# Altium schematic sheet igrid_sensor.SchDoc
size A3
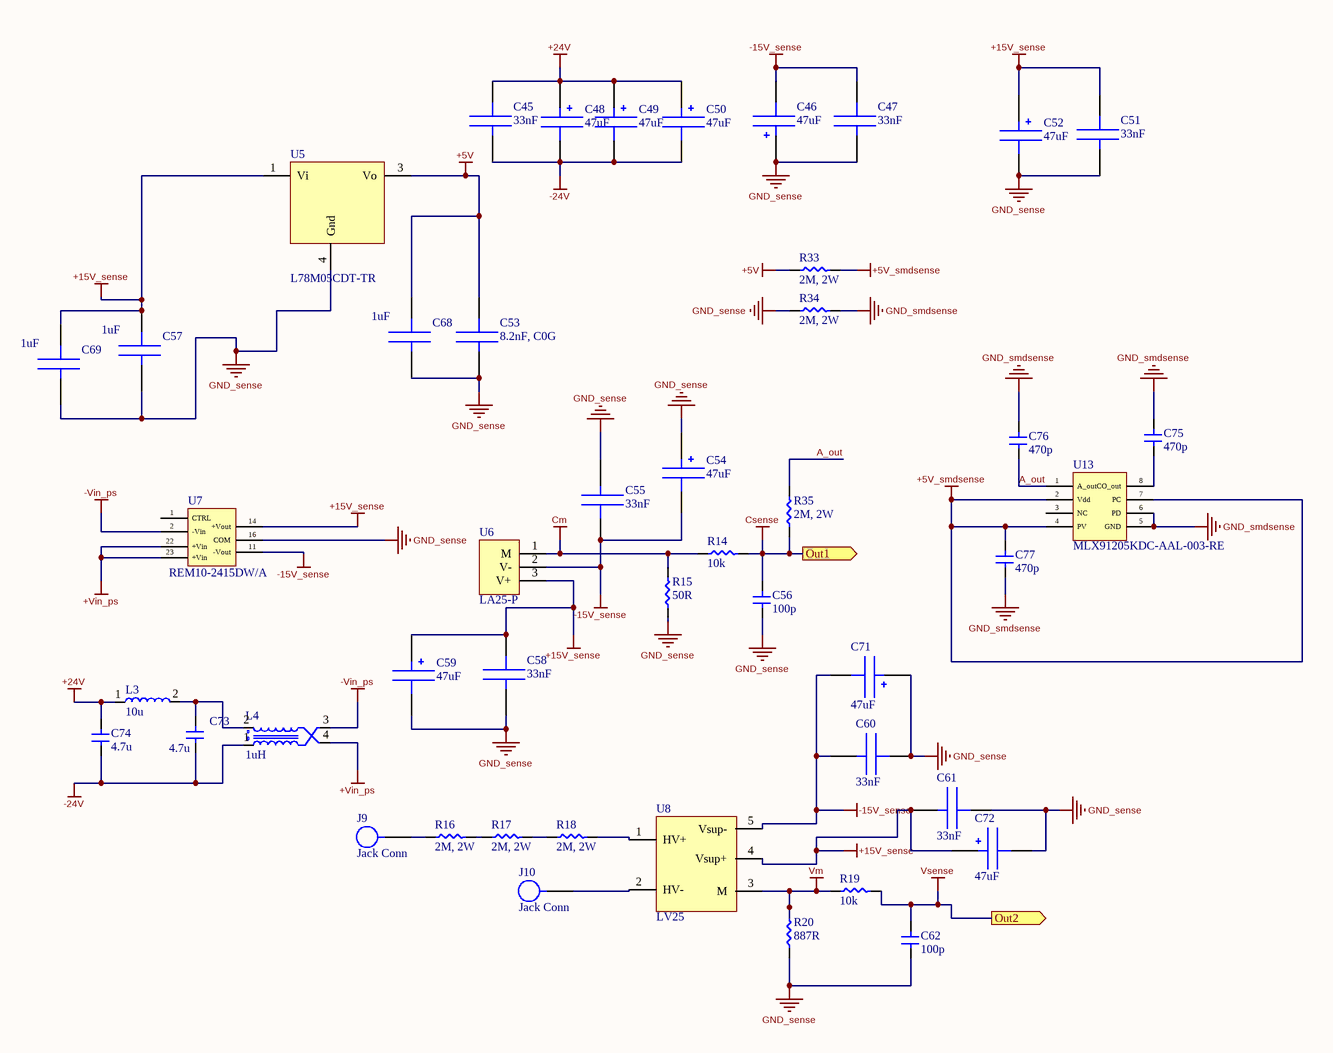
[diagram p0: igrid_sensor.SchDoc]

## Parts
C45  33nF  [C1206]
C46  47uF  [CAPAE7266X82N]
C47  33nF  [C1206]
C48  47uF  [CAPAE7266X82N]
C49  47uF  [CAPAE7266X82N]
C50  47uF  [CAPAE7266X82N]
C51  33nF  [C1206]
C52  47uF  [CAPAE7266X82N]
C53  8.2nF, C0G  [C1206]
C54  47uF  [CAPAE7266X82N]
C55  33nF  [C1206]
C56  100p  [C0603]
C57  1uF  [C1206]
C58  33nF  [C1206]
C59  47uF  [CAPAE7266X82N]
C60  33nF  [C1206]
C61  33nF  [C1206]
C62  100p  [C0603]
C68  1uF  [C1206]
C69  1uF  [C1206]
C71  47uF  [CAPAE7266X82N]
C72  47uF  [CAPAE7266X82N]
C73  4.7u  [C0805]
C74  4.7u  [C0805]
C75  470p  [C0603]
C76  470p  [C0603]
C77  470p  [C0603]
J9  Jack Conn  [575-4]
J10  Jack Conn  [575-4]
L3  10u  [SRP4020TA-100M]
L4  1uH  [744282010]
R14  10k  [R0603]
R15  50R  [R0603]
R16  2M, 2W  [R2010]
R17  2M, 2W  [R2010]
R18  2M, 2W  [R2010]
R19  10k  [R0603]
R20  887R  [R0603]
R33  2M, 2W  [R2010]
R34  2M, 2W  [R2010]
R35  2M, 2W  [R2010]
U5  L78M05CDT-TR  [DPAK_LM7805]
U6  LA25-P  [LA 25-P]
U7  REM10-2415DW/A  [REM10-2415DW/A]
U8  LV25  [LV25-P]
U13  MLX91205KDC-AAL-003-RE  [SOIC-8]

## Ports
Out1 (out), Out2 (out)

## Nets
+5V: C53.2 C68.2 R33.1 U5.3(Vo)
+5V_smdsense: C77.2 R33.2 U13.2(Vdd) U13.4(PV) U13.7(PC)
+15V_sense: C51.2 C52.1 C57.2 C58.2 C59.1 C61.1 C69.2 C72.1 U5.1(Vi) U6.3(V+) U7.14(+Vout) U8.4(Vsup+)
+24V: C45.2 C48.1 C49.1 C50.1 C74.2 L3.1
+Vin_ps: L4.4 U7.22(+Vin) U7.23(+Vin)
-15V_sense: C46.2 C47.2 C54.2 C55.2 C60.1 C71.2 U6.2(V-) U7.11(-Vout) U8.5(Vsup-)
-24V: C45.1 C48.2 C49.2 C50.2 C73.1 C74.1 L4.1
-Vin_ps: L4.3 U7.2(-Vin)
Cm: R14.1 R15.2 U6.1(M)
Csense: C56.2 R14.2 R35.1 ; port Out1
GND_sense: C46.1 C47.1 C51.1 C52.2 C53.1 C54.1 C55.1 C56.1 C57.1 C58.1 C59.2 C60.2 C61.2 C62.1 C68.1 C69.1 C71.1 C72.2 R15.1 R20.1 R34.1 U5.4(Gnd) U7.16(COM)
GND_smdsense: C75.2 C76.2 C77.1 R34.2 U13.5(GND) U13.6(PD)
Vm: R19.1 R20.2 U8.3(M)
Vsense: C62.2 R19.2 ; port Out2
A_out: C76.1 R35.2 U13.1(A_out)
NetC73_2: C73.2 L3.2 L4.2
NetC75_1: C75.1 U13.8(CO_out)
NetJ9_1: J9.1 R16.1
NetJ10_1: J10.1 U8.2(HV-)
NetR16_2: R16.2 R17.1
NetR17_2: R17.2 R18.1
NetR18_2: R18.2 U8.1(HV+)

Not connected (* = marked no-connect by the designer): U7 1(CTRL); U13 3(NC)

## Library data of the parts
C45 C47 C51 C55 C58 C60 C61 = CL31B333JBCNNNC: Cap Ceramic 0.033uF 50V X7R 5% SMD 1206 125C Paper T/R; Manufacturer: Samsung; Supplier 1: Digi-Key; Manufacturer Part Number: CL31B333JBCNNNC; Stock 1: 21; Pricing 1: 1=0.18, 10=0.131, 100=0.0614, 500=0.04308, 1000=0.03567 (USD); Mount: Surface Mount; Case/Package: 1206; Case Code (Metric): 3216; Case Code (Imperial): 1206; Min Operating Temperature: -55°C; Max Operating Temperature: 125°C; Tolerance: 5%; Packaging: Tape and Reel; Capacitance: 33nF; Voltage Rating: 50V; Package Quantity: 1; Dielectric: X7R; Voltage: 50V; Voltage Rating (DC): 50V; Length: 3.2mm; Height: 0.85mm; Width: 0.063inch; Thickness: 0.039inch; Depth: 1.6mm; Radiation Hardening: No; Lead Free: Lead Free; Supplier Part Number 1: 1276-1774-6-ND
C46 C48-C50 C52 C54 C59 C71 C72 = UCD1H470MCL1GS: Aluminum Electrolytic Capacitors - SMD 47uF 50V 105c; Manufacturer: Nichicon; Tolerance: 20%; Impedance: 630mR; Life (Hours): 2000Hour; Ripple Current: 195mA; Leakage Current: 493.5uA; Dissipation Factor: 0.1%; Supplier 1: Digi-Key; Manufacturer Part Number: UCD1H470MCL1GS; Stock 1: 232; Pricing 1: 1=0.55, 10=0.39, 100=0.2566 (USD); Mount: Surface Mount; Case/Package: Radial; Min Operating Temperature: -55°C; Max Operating Temperature: 105°C; Capacitance: 47uF; Voltage Rating: 50V; Packaging: Tape and Reel; Package Quantity: 1; Voltage Rating (DC): 50V; Termination: SMD/SMT; Voltage: 50V; Diameter: 6.3mm; Length: 7.7mm; Height: 7.7mm; Height - Seated (Max): 0.315inch; Radiation Hardening: No; Lead Free: Lead Free; ComponentLink1URL: http://www.nichicon.co.jp/english/products/pdfs/e-cd.pdf; ComponentLink1Description: http://www.nichicon.co.jp/english/products/pdfs/e-cd.pdf; ComponentLink2URL: http://nichicon-us.com/english/products/pdfs/e-ucd.pdf; ComponentLink2Description: http://nichicon-us.com/english/products/pdfs/e-ucd.pdf; ComponentLink3URL: http://uk.rs-online.com/webdocs/0ebd/0900766b80ebdadd.pdf; ComponentLink3Description: http://uk.rs-online.com/webdocs/0ebd/0900766b80ebdadd.pdf; ComponentLink4URL: http://products.nichicon.co.jp/en/pdf/XJA043/e-cd.pdf; ComponentLink4Description: http://products.nichicon.co.jp/en/pdf/XJA043/e-cd.pdf; Supplier Part Number 1: 493-6183-6-ND
C53 = C1206C822JAGACAUTO: Multilayer Ceramic Capacitors MLCC - SMD/SMT 250volts 8200pF 5% C0G AUTO; Manufacturer: KEMET; Voltage Rating: 250V; Supplier 1: Digi-Key; Manufacturer Part Number: C1206C822JAGACAUTO; Stock 1: 3011; Pricing 1: 1=0.69, 10=0.489, 100=0.3223, 500=0.23872, 1000=0.20292 (USD); Mount: Surface Mount; Case/Package: 1206; Weight: 0.000353oz; Case Code (Metric): 3216; Case Code (Imperial): 1206; Dielectric Material: Ceramic; Min Operating Temperature: -55°C; Max Operating Temperature: 125°C; Capacitance: 8.2nF; Packaging: Tape and Reel; Tolerance: 5%; Dielectric: C0G; Termination: SMD/SMT; Voltage Rating (DC): 250V; Package Quantity: 4000; Length: 0.126inch; Width: 1.6mm; Thickness: 0.039inch; Ratings: AEC-Q200; Lead Free: Lead Free; Supplier Part Number 1: 399-11910-6-ND
C56 C62 = 06035C101KAT2A: Cap Ceramic 100pF 50V X7R 10% SMD 0603 125C T/R; Manufacturer: Kyocera AVX; Dissipation Factor: 2.5%; Temperature Coefficient: 0ppm/°C; Supplier 1: Mouser; Manufacturer Part Number: 06035C101KAT2A; Stock 1: 28330; Pricing 1: 1=0.27, 10=0.181, 50=0.181, 100=0.091, 1000=0.055, 10000=0.038 (USD); Mount: Surface Mount; Case/Package: 0603; Number of Pins: 2; Case Code (Metric): 1608; Case Code (Imperial): 0603; Contact Plating: Tin,Matte; Dielectric Material: Ceramic; Min Operating Temperature: -55°C; Max Operating Temperature: 125°C; Package Quantity: 1; Capacitance: 100pF; Tolerance: 10%; Packaging: Tape and Reel; Voltage Rating: 50V; Voltage Rating (DC): 50V; Dielectric: X7R; Termination: SMD/SMT; Length: 1.6mm; Width: 0.032inch; Thickness: 0.035inch; Depth: 0.81mm; Radiation Hardening: No; REACH SVHC: No SVHC; Lead Free: Lead Free; ComponentLink1URL: http://www.mouser.com/ds/2/40/X7RDielectric-777024.pdf?src-supplier=Mouser; ComponentLink1Description: http://www.mouser.com/ds/2/40/X7RDielectric-777024.pdf?src-supplier=Mouser; ComponentLink2URL: http://www.farnell.com/datasheets/1679506.pdf?src-supplier=Element14; ComponentLink2Description: http://www.farnell.com/datasheets/1679506.pdf?src-supplier=Element14; ComponentLink3URL: http://www.jameco.com/Jameco/Products/ProdDS/2012486.pdf?src-supplier=Jameco; ComponentLink3Description: http://www.jameco.com/Jameco/Products/ProdDS/2012486.pdf?src-supplier=Jameco; ComponentLink4URL: http://www.avx.com/docs/Catalogs/cx7r.pdf?src-supplier=Future+Electronics; ComponentLink4Description: http://www.avx.com/docs/Catalogs/cx7r.pdf?src-supplier=Future+Electronics; ComponentLink5URL: http://catalogs.avx.com/SurfaceMount.pdf?src-supplier=Digi-Key; ComponentLink5Description: http://catalogs.avx.com/SurfaceMount.pdf?src-supplier=Digi-Key; Supplier Part Number 1: 581-06035C101K
C57 C68 C69 = C1206C822JAGACAUTO: Multilayer Ceramic Capacitors MLCC - SMD/SMT 250volts 8200pF 5% C0G AUTO; Manufacturer: KEMET; Capacitance: 8.2nF; Voltage Rating: 250V; Supplier 1: Digi-Key; Manufacturer Part Number: C1206C822JAGACAUTO; Stock 1: 3011; Pricing 1: 1=0.69, 10=0.489, 100=0.3223, 500=0.23872, 1000=0.20292 (USD); Mount: Surface Mount; Case/Package: 1206; Weight: 0.000353oz; Case Code (Metric): 3216; Case Code (Imperial): 1206; Dielectric Material: Ceramic; Min Operating Temperature: -55°C; Max Operating Temperature: 125°C; Packaging: Tape and Reel; Tolerance: 5%; Dielectric: C0G; Termination: SMD/SMT; Voltage Rating (DC): 250V; Package Quantity: 4000; Length: 0.126inch; Width: 1.6mm; Thickness: 0.039inch; Ratings: AEC-Q200; Lead Free: Lead Free; Supplier Part Number 1: 399-11910-6-ND
C73 C74 = CGA4C2C0G1H103J060AA: CAP CER 10000PF 50V C0G 0805; Manufacturer: TDK; Tolerance: 5%; Capacitance: 10nF; Supplier 1: Digi-Key; Manufacturer Part Number: CGA4C2C0G1H103J060AA; Stock 1: 310; Pricing 1: 1=0.4, 10=0.273, 100=0.1548, 500=0.1093, 1000=0.09563 (USD); Mount: Surface Mount; Case/Package: 0805; Weight: 0.000194oz; Case Code (Metric): 2012; Case Code (Imperial): 0805; Min Operating Temperature: -55°C; Max Operating Temperature: 125°C; Packaging: Tape and Reel; Package Quantity: 1; Voltage Rating: 50V; Voltage Rating (DC): 50V; Dielectric: C0G; Termination: SMD/SMT; Composition: Ceramic; Length: 2mm; Height: 0.6mm; Width: 0.049inch; Thickness: 0.028inch; Depth: 1.25mm; Ratings: AEC-Q200; Radiation Hardening: No; REACH SVHC: No SVHC; Lead Free: Lead Free; ComponentLink1URL: https://www.verical.com/server-webapp/html/getDatasheet?partID=712412; ComponentLink1Description: https://www.verical.com/server-webapp/html/getDatasheet?partID=712412; ComponentLink2URL: http://www.mouser.com/ds/2/400/lcc_automotive_general_en-843974.pdf; ComponentLink2Description: http://www.mouser.com/ds/2/400/lcc_automotive_general_en-843974.pdf; Supplier Part Number 1: 445-6947-6-ND
C75-C77 = CC0603KRX7R9BB471: Manufacturer: Yageo; Dielectric Material: Ceramic; Capacitance: 470pF; Tolerance: 10%; Voltage Rating: 50V; Dielectric: X7R; Insulation Resistance: 10GR; Dissipation Factor: 2.5%; Supplier 1: Mouser; Manufacturer Part Number: CC0603KRX7R9BB471; Stock 1: 58906; Pricing 1: 1=0.1, 10=0.039, 50=0.039, 100=0.018, 1000=0.014, 10000=0.01 (USD); Mount: Surface Mount; Case/Package: 0603; Number of Pins: 2; Case Code (Imperial): 0603; Case Code (Metric): 1608; Min Operating Temperature: -55°C; Max Operating Temperature: 125°C; Voltage Rating (DC): 50V; Packaging: Tape and Reel; Package Quantity: 1; Termination: SMD/SMT; Composition: Ceramic; Length: 1.6mm; Height: 0.8mm; Width: 0.8mm; Thickness: 0.035inch; Depth: 0.8mm; Radiation Hardening: No; REACH SVHC: No SVHC; Lead Free: Lead Free; Halogen Free: Halogen Free; ComponentLink1URL: http://www.mouser.com/ds/2/447/Yageo_UPY-GP_NP0_16V-to-50V_9-358835.pdf?src-supplier=Mouser; ComponentLink1Description: http://www.mouser.com/ds/2/447/Yageo_UPY-GP_NP0_16V-to-50V_9-358835.pdf?src-supplier=Mouser; ComponentLink2URL: http://www.yageo.com/documents/recent/UPY-GPHC_X7R_6.3V-to-50V_18.pdf?src-supplier=Digi-Key; ComponentLink2Description: http://www.yageo.com/documents/recent/UPY-GPHC_X7R_6.3V-to-50V_18.pdf?src-supplier=Digi-Key; ComponentLink3URL: http://www.yageo.com/documents/recent/UPY-GPHC_X7R_6.3V-to-50V_8.pdf?src-supplier=Avnet; ComponentLink3Description: http://www.yageo.com/documents/recent/UPY-GPHC_X7R_6.3V-to-50V_8.pdf?src-supplier=Avnet; ComponentLink4URL: http://www.yageo.com/documents/recent/UPY-GPHC_X7R_6.3V-to-50V_8.pdf?src-supplier=Avnet+Europe; ComponentLink4Description: http://www.yageo.com/documents/recent/UPY-GPHC_X7R_6.3V-to-50V_8.pdf?src-supplier=Avnet+Europe; ComponentLink5URL: http://www.farnell.com/datasheets/1489800.pdf?src-supplier=Element14; ComponentLink5Description: http://www.farnell.com/datasheets/1489800.pdf?src-supplier=Element14; ComponentLink6URL: https://www.verical.com/server-webapp/html/getDatasheet?partID=251791&src-supplier=Verical; ComponentLink6Description: https://www.verical.com/server-webapp/html/getDatasheet?partID=251791&src-supplier=Verical; ComponentLink7URL: http://www.farnell.com/datasheets/70765.pdf?src-supplier=Element14; ComponentLink7Description: http://www.farnell.com/datasheets/70765.pdf?src-supplier=Element14; Supplier Part Number 1: 603-CC603KRX7R9BB471
J9 J10 = 575-4: JACK NON-INSULATED .218"; Manufacturer: Keystone Electronics; Gender: Female; Number of Positions: 1; Supplier 1: Digi-Key; Manufacturer Part Number: 575-4; Stock 1: 21251; Pricing 1: 1=0.84, 10=0.692, 50=0.6244, 250=0.543, 1000=0.4558, 2500=0.4073, 5000=0.3801 (USD); Mount: Panel,Through Hole; Number of Pins: 1; Contact Plating: Nickel; Color: White; Contact Material: Brass; Material: Brass,Tin; Packaging: Bulk; Package Quantity: 100; Termination: Solder; Insulation: Non-Insulated; Lead Free: Lead Free; ComponentLink1URL: http://www.mouser.com/ds/2/215/75-4_575-8-743912.pdf?src-supplier=Mouser; ComponentLink1Description: http://www.mouser.com/ds/2/215/75-4_575-8-743912.pdf?src-supplier=Mouser; ComponentLink2URL: http://www.keyelco.com/pdfs/M60/M60p107.pdf?src-supplier=Digi-Key; ComponentLink2Description: http://www.keyelco.com/pdfs/M60/M60p107.pdf?src-supplier=Digi-Key; Supplier Part Number 1: 36-575-4-ND
L3 = SRP4020TA-100M: Ind Power Shielded Wirewound 10uH 20% 100KHz Carbonyl Powder 1.8A T/R; Manufacturer: Bourns; Saturation Current: 2.3A; DC Resistance (DCR): 243mR; Self Resonant Frequency: 19MHz; Supplier 1: Digi-Key; Manufacturer Part Number: SRP4020TA-100M; Stock 1: 12652; Pricing 1: 1=1.49, 10=1.383, 100=0.9999, 500=0.7659, 1000=0.6808 (USD); Mount: Surface Mount; Case/Package: SMD/SMT; Number of Pins: 2; Core Material: Carbonyl Powder; Min Operating Temperature: -40°C; Max Operating Temperature: 150°C; Tolerance: 20%; Packaging: Cut Tape; Composition: Wirewound; Inductance: 10uH; Current Rating: 1.8A; Shielding: Shielded; Test Frequency: 100kHz; Max DC Current: 1.8A; Termination: SMD/SMT; RMS Current (Irms): 1.8A; Inductance Tolerance: 20%; Length: 0.175inch; Height: 1.8mm; Width: 0.16inch; Height - Seated (Max): 0.079inch; Depth: 4.06mm; Ratings: AEC-Q200; REACH SVHC: No SVHC; ComponentLink1URL: http://www.bourns.com/docs/Product-Datasheets/SRP4020TA.pdf?src-supplier=Digi-Key; ComponentLink1Description: http://www.bourns.com/docs/Product-Datasheets/SRP4020TA.pdf?src-supplier=Digi-Key; ComponentLink2URL: http://www.bourns.com/data/global/pdfs/SRP4020TA.pdf?src-supplier=Avnet; ComponentLink2Description: http://www.bourns.com/data/global/pdfs/SRP4020TA.pdf?src-supplier=Avnet; ComponentLink3URL: https://media.digikey.com/pdf/Data%20Sheets/Bourns%20PDFs/SRP4012TA_SRP4020TA_Series_Bltn.pdf?src-supplier=Digi-Key; ComponentLink3Description: https://media.digikey.com/pdf/Data%20Sheets/Bourns%20PDFs/SRP4012TA_SRP4020TA_Series_Bltn.pdf?src-supplier=Digi-Key; ComponentLink4URL: http://www.farnell.com/datasheets/2059708.pdf?src-supplier=Newark; ComponentLink4Description: http://www.farnell.com/datasheets/2059708.pdf?src-supplier=Newark; ComponentLink5URL: http://www.alliedelec.com/images/products/datasheets/bm/BOURNS/70418822.pdf?src-supplier=Allied+Electronics; ComponentLink5Description: http://www.alliedelec.com/images/products/datasheets/bm/BOURNS/70418822.pdf?src-supplier=Allied+Electronics; ComponentLink6URL: http://www.farnell.com/datasheets/2059708.pdf?src-supplier=Farnell; ComponentLink6Description: http://www.farnell.com/datasheets/2059708.pdf?src-supplier=Farnell; ComponentLink7URL: http://www.farnell.com/datasheets/2059708.pdf?src-supplier=Element14; ComponentLink7Description: http://www.farnell.com/datasheets/2059708.pdf?src-supplier=Element14; Supplier Part Number 1: SRP4020TA-100MDKR-ND
L4 = 744282010: CHOKE COM MODE 2 X 1.0UH 4.75A; Manufacturer: Wurth Electronics; Core Material: Ferrite; Impedance: 1.6kR; Number of Lines: 2; Tolerance: 20%; Resistance: 12mR; DC Resistance (DCR): 10mR; Test Frequency: 100kHz; Voltage Rating (DC): 80V; Supplier 1: Digi-Key; Manufacturer Part Number: 744282010; Stock 1: 804; Pricing 1: 1=3.1, 10=3.055, 50=2.76, 100=2.661, 250=2.464 (USD); Mount: Surface Mount; Case/Package: 1260; Min Operating Temperature: -40°C; Max Operating Temperature: 125°C; Package Quantity: 500; Packaging: Tape and Reel; Inductance: 1uH; Current Rating: 4.75A; Current: 4.75A; Max DC Current: 4.75A; Termination: SMD/SMT; Length: 12.5mm; Height: 6.5mm; Width: 12.5mm; Depth: 12.5mm; REACH SVHC: No SVHC; ComponentLink1URL: http://www.farnell.com/datasheets/1735690.pdf?src-supplier=Element14; ComponentLink1Description: http://www.farnell.com/datasheets/1735690.pdf?src-supplier=Element14; ComponentLink2URL: http://katalog.we-online.de/pbs/datasheet/744282010.pdf?src-supplier=Digi-Key; ComponentLink2Description: http://katalog.we-online.de/pbs/datasheet/744282010.pdf?src-supplier=Digi-Key; ComponentLink3URL: https://katalog.we-online.de/pbs/datasheet/744282010.pdf?src-supplier=Digi-Key; ComponentLink3Description: https://katalog.we-online.de/pbs/datasheet/744282010.pdf?src-supplier=Digi-Key; ComponentLink4URL: http://documents.rs-components.com/techlib://itc_doclist_GB.htm?stockno=7445283&src-supplier=RSComponents; ComponentLink4Description: http://documents.rs-components.com/techlib://itc_doclist_GB.htm?stockno=7445283&src-supplier=RSComponents; ComponentLink5URL: http://www.mouser.com/ds/2/445/744282010-244044.pdf?src-supplier=Mouser; ComponentLink5Description: http://www.mouser.com/ds/2/445/744282010-244044.pdf?src-supplier=Mouser; Supplier Part Number 1: 732-2965-6-ND
R14 R19 = RNCP0603FTD10K0: RES 10K OHM 1% 1/8W 0603; Manufacturer: Stackpole Electronics; Resistance: 10kR; Max Power Dissipation: 125mW; Temperature Coefficient: 100ppm/°C; Supplier 1: Digi-Key; Manufacturer Part Number: RNCP0603FTD10K0; Stock 1: 166858; Pricing 1: 1=0.1, 10=0.067, 100=0.0273, 1000=0.01224, 2500=0.01063 (USD); Mount: Surface Mount; Case/Package: 0603; Case Code (Metric): 1608; Case Code (Imperial): 0603; Contact Plating: Tin,Matte; Min Operating Temperature: -55°C; Max Operating Temperature: 155°C; Packaging: Tape and Reel; Tolerance: 1%; Composition: Thin Film; Number of Terminations: 2; Features: Moisture Resistant,Anti-Sulfur; Length: 0.059inch; Height: 0.02inch; Width: 0.031inch; Radiation Hardening: No; Lead Free: Lead Free; Supplier Part Number 1: RNCP0603FTD10K0CT-ND
R15 = ERA3AEB7320V: PANASONIC ELECTRONIC COMPONENTS   ERA3AEB7320V   Surface Mount Chip Resistor, Thin Film, AEC-Q200 ERA Series, 732 ohm, 100 mW,  0.1%, 75 V; Resistance: 732R; Power Rating: 100mW; Voltage Rating: 75V; Temperature Coefficient: 25ppm/°C; Supplier 1: Digi-Key; Manufacturer: Panasonic; Manufacturer Part Number: ERA3AEB7320V; Stock 1: 41685; Pricing 1: 1=0.35, 10=0.3, 100=0.1172, 1000=0.04906, 2500=0.04498 (USD); Mount: Surface Mount; Case/Package: 0603; Number of Pins: 2; Case Code (Metric): 1608; Case Code (Imperial): 0603; Contact Plating: Tin; Min Operating Temperature: -55°C; Max Operating Temperature: 155°C; Tolerance: 0.1%; Packaging: Tape and Reel; Package Quantity: 1; Composition: Metal Film,Thin Film; Number of Terminations: 2; Termination: SMD/SMT; Max Power Dissipation: 100mW; Voltage Rating (DC): 75V; Features: Automotive AEC-Q200; Length: 1.6mm; Height: 0.45mm; Width: 0.8mm; Depth: 0.8mm; Radiation Hardening: No; REACH SVHC: No SVHC; Lead Free: Lead Free; ComponentLink1URL: http://uk.rs-online.com/webdocs/0eb1/0900766b80eb1d8c.pdf; ComponentLink1Description: http://uk.rs-online.com/webdocs/0eb1/0900766b80eb1d8c.pdf; ComponentLink2URL: http://industrial.panasonic.com/www-data/pdf/AOA0000/AOA0000CE26.pdf; ComponentLink2Description: http://industrial.panasonic.com/www-data/pdf/AOA0000/AOA0000CE26.pdf; ComponentLink3URL: http://www.farnell.com/datasheets/485442.pdf; ComponentLink3Description: http://www.farnell.com/datasheets/485442.pdf; Supplier Part Number 1: P732DBDKR-ND
R16-R18 R33-R35 = 35022M0FT: Supplied as a Tape, 2MΩ 2010 Thick Film SMD Resistor ±1% 2W - 35022M0FT; Manufacturer: TE Connectivity; Supplier 1: Digi-Key; Manufacturer Part Number: 35022M0FT; Stock 1: 3998; Pricing 1: 1=0.81, 10=0.706, 100=0.4917, 1000=0.28863 (USD); ComponentLink1URL: http://datasheet.octopart.com/35022M0FT-TE-Connectivity-datasheet-130072828.pdf?src-supplier=TE+Connectivity; ComponentLink1Description: http://datasheet.octopart.com/35022M0FT-TE-Connectivity-datasheet-130072828.pdf?src-supplier=TE+Connectivity; ComponentLink2URL: http://sigma.octopart.com/130072830/technical_drawing/TE-Connectivity-35022M0FT.pdf?src-supplier=TE+Connectivity; ComponentLink2Description: http://sigma.octopart.com/130072830/technical_drawing/TE-Connectivity-35022M0FT.pdf?src-supplier=TE+Connectivity; Supplier Part Number 1: A143274CT-ND
R20 = ERA-3AEB8870V: RES SMD 887 OHM 0.1% 1/10W 0603; Manufacturer: Panasonic; Max Power Dissipation: 100mW; Temperature Coefficient: 25ppm/°C; Supplier 1: Digi-Key; Manufacturer Part Number: ERA-3AEB8870V; Stock 1: 18104; Pricing 1: 1=0.35, 10=0.3, 100=0.1172, 1000=0.04906, 2500=0.04498 (USD); Case/Package: 0603; Case Code (Imperial): 0603; Case Code (Metric): 1608; Min Operating Temperature: -55°C; Max Operating Temperature: 155°C; Composition: Thin Film; Features: Automotive AEC-Q200; Packaging: Tape and Reel; Resistance: 887R; Tolerance: 0.1%; Number of Terminations: 2; Length: 0.063inch; Width: 0.032inch; Height - Seated (Max): 0.022inch; Supplier Part Number 1: P887DBDKR-ND
U5 = L78M05CDT-TR: STMICROELECTRONICS   L78M05CDT-TR   LINEAR VOLTAGE REGULATOR, 5V, DPAK-3; Number of Outputs: 1; Min Input Voltage: 7V; Max Input Voltage: 35V; Output Current: 500mA; Dropout Voltage: 2V; Polarity: Positive; Quiescent Current: 6mA; Tolerance: 5%; Power Supply Rejection Ratio (PSRR): 62dB; Output Type: Fixed; Supplier 1: Digi-Key; Manufacturer: STMicroelectronics; Manufacturer Part Number: L78M05CDT-TR; Stock 1: 22314; Pricing 1: 1=0.47, 10=0.404, 100=0.3014, 500=0.2368, 1000=0.18299 (USD); Mount: Surface Mount; Case/Package: TO-252; Number of Pins: 3; Weight: 0.01lb; Contact Plating: Tin,Matte; Min Operating Temperature: 0°C; Max Operating Temperature: 150°C; Packaging: Tape and Reel; Package Quantity: 1; Output Voltage: 5V; Nominal Output Voltage: 5V; Max Output Current: 500mA; Number of Regulators: 1; Min Output Voltage: 5V; Max Output Voltage: 5V; Length: 6.6mm; Height: 2.4mm; Width: 6.2mm; Radiation Hardening: No; REACH SVHC: No SVHC; Lead Free: Lead Free; ComponentLink1URL: http://www.mouser.com/ds/2/389/l78m-974157.pdf?src-supplier=Mouser; ComponentLink1Description: http://www.mouser.com/ds/2/389/l78m-974157.pdf?src-supplier=Mouser; ComponentLink2URL: http://www.st.com/web/en/resource/technical/document/datasheet/CD00000447.pdf?src-supplier=Future+Electronics; ComponentLink2Description: http://www.st.com/web/en/resource/technical/document/datasheet/CD00000447.pdf?src-supplier=Future+Electronics; ComponentLink3URL: http://www.st.com/content/ccc/resource/technical/document/datasheet/d7/5f/dc/5c/d5/b6/48/7c/CD00000447.pdf/files/CD00000447.pdf/jcr:content/translations/en.CD00000447.pdf?src-supplier=Digi-Key; ComponentLink3Description: http://www.st.com/content/ccc/resource/technical/document/datasheet/d7/5f/dc/5c/d5/b6/48/7c/CD00000447.pdf/files/CD00000447.pdf/jcr:content/translations/en.CD00000447.pdf?src-supplier=Digi-Key; ComponentLink4URL: https://www.verical.com/server-webapp/html/getDatasheet?partID=111001&src-supplier=Verical; ComponentLink4Description: https://www.verical.com/server-webapp/html/getDatasheet?partID=111001&src-supplier=Verical; ComponentLink5URL: https://www.distrelec.biz/Web/Downloads/ta/_e/tbL78MxxC_data_e.pdf?mime=application%2Fpdf&src-supplier=Distrelec; ComponentLink5Description: https://www.distrelec.biz/Web/Downloads/ta/_e/tbL78MxxC_data_e.pdf?mime=application%2Fpdf&src-supplier=Distrelec; ComponentLink6URL: http://www.farnell.com/datasheets/1834365.pdf?src-supplier=Element14; ComponentLink6Description: http://www.farnell.com/datasheets/1834365.pdf?src-supplier=Element14; ComponentLink7URL: http://www.jameco.com/Jameco/Products/ProdDS/2021024.pdf?src-supplier=Jameco; ComponentLink7Description: http://www.jameco.com/Jameco/Products/ProdDS/2021024.pdf?src-supplier=Jameco; ComponentLink8URL: http://www.produktinfo.conrad.com/datenblaetter/1100000-1199999/001184659-da-01-en-IC_REG_LDO_5V_L78M05CDT_TR_TO_252_3_STM.pdf?src-supplier=Conrad; ComponentLink8Description: http://www.produktinfo.conrad.com/datenblaetter/1100000-1199999/001184659-da-01-en-IC_REG_LDO_5V_L78M05CDT_TR_TO_252_3_STM.pdf?src-supplier=Conrad; Supplier Part Number 1: 497-1203-6-ND
U6 = LA25-P: Manufacturer: LEM; Operating Supply Voltage: 15V; Max Supply Current: 10mA; Number of Channels: 1; Frequency: 200kHz; Response Time: 1us; Polarity: Bidirectional; Linearity: 0.15%; Accuracy: 0.91%; Current Sensing: 25A; Supplier 1: Digi-Key; Manufacturer Part Number: LA25-P; Stock 1: 0; Pricing 1: 1=72.3 (USD); Mount: Through Hole,PCB; Min Operating Temperature: -25°C; Max Operating Temperature: 85°C; Packaging: Bulk; Supplier Part Number 1: LA25-P-ND
U7 = REM10-2415DW/A: Isolated DC/DC Converters 10W 9-36Vin +/-15Vout DIP24; Manufacturer: Recom; Number of Outputs: 2; Min Input Voltage: 9V; Max Input Voltage: 36V; Voltage - Output 1: 15V; Voltage - Output 2: -15V; Max Output Current: 333mA; Isolation Voltage: 5kV; Efficiency: 88%; Current - Output 2: -333mA; Supplier 1: Digi-Key; Manufacturer Part Number: REM10-2415DW/A; Stock 1: 37; Pricing 1: 1=79.15, 5=78.534, 10=77.915, 25=75.4416, 50=71.7316, 100=66.7845 (USD); Mount: Through Hole; Case/Package: DIP; Weight: 14g; Min Operating Temperature: -40°C; Max Operating Temperature: 105°C; Packaging: Rail/Tube; Max Power Dissipation: 10W; Output Power: 10W; Current - Output 1: 333mA; Package Quantity: 7; Max Output Voltage: 15V; Features: UVLO,OVP,OCP,SCP; Length: 31.8mm; Height: 10.4mm; Width: 20.3mm; Lead Free: Lead Free; ComponentLink1URL: https://media.digikey.com/pdf/Data%20Sheets/Recom%20Power%20Inc%20PDFs/REM10_Dim_Dwg.pdf?src-supplier=Digi-Key; ComponentLink1Description: https://media.digikey.com/pdf/Data%20Sheets/Recom%20Power%20Inc%20PDFs/REM10_Dim_Dwg.pdf?src-supplier=Digi-Key; ComponentLink2URL: http://www.mouser.com/ds/2/468/REM10-S_D_W-958491.pdf?src-supplier=Mouser; ComponentLink2Description: http://www.mouser.com/ds/2/468/REM10-S_D_W-958491.pdf?src-supplier=Mouser; Supplier Part Number 1: 945-2243-ND
U8 = LV25-P: Manufacturer: LEM; Secondary Current: 25mA; Min Supply Voltage: -15V; Max Supply Voltage: 15V; Response Time: 40us; Input Current: 10mA; Accuracy: 0.9%; Output Type: Voltage; Supplier 1: Digi-Key; Manufacturer Part Number: LV25-P; Stock 1: 51; Pricing 1: 1=68, 5=64.6, 10=59.5, 25=52.7, 50=51, 100=49.3 (USD); Mount: PCB; Min Operating Temperature: 0°C; Max Operating Temperature: 70°C; Max Output Current: 25mA; Current Rating: 10mA; Height: 15.1mm; Width: 26mm; Lead Free: Contains Lead; REACH SVHC: No SVHC; ComponentLink1URL: https://www.lem.com/sites/default/files/products_datasheets/lv_25-p.pdf?src-supplier=Digi-Key; ComponentLink1Description: https://www.lem.com/sites/default/files/products_datasheets/lv_25-p.pdf?src-supplier=Digi-Key; ComponentLink2URL: https://www.distrelec.biz/Web/Downloads/_t/ds/LV25P_eng_tds.pdf?mime=application%2Fpdf&src-supplier=Distrelec; ComponentLink2Description: https://www.distrelec.biz/Web/Downloads/_t/ds/LV25P_eng_tds.pdf?mime=application%2Fpdf&src-supplier=Distrelec; ComponentLink3URL: http://www.farnell.com/datasheets/51633.pdf?src-supplier=Newark; ComponentLink3Description: http://www.farnell.com/datasheets/51633.pdf?src-supplier=Newark; ComponentLink4URL: http://www.farnell.com/datasheets/1866272.pdf?src-supplier=Element14; ComponentLink4Description: http://www.farnell.com/datasheets/1866272.pdf?src-supplier=Element14; ComponentLink5URL: http://datasheet.iiic.cc/lem/LV25-P.pdf?src-supplier=IIIC; ComponentLink5Description: http://datasheet.iiic.cc/lem/LV25-P.pdf?src-supplier=IIIC; Supplier Part Number 1: 398-1019-ND
U13 = MLX91205KDC-AAL-003-RE: SENSOR CURRENT HALL 10MT AC/DC; Manufacturer: Melexis; Number of Channels: 1; Frequency: 100kHz; Output Current: 1mA; Operating Supply Voltage: 5.5V; Nominal Supply Current: 11mA; Response Time: 8us; Max Supply Current: 16mA; Polarity: Bidirectional; Linearity: 0.5%; Accuracy: 2%; Supplier 1: Digi-Key; Manufacturer Part Number: MLX91205KDC-AAL-003-RE; Stock 1: 0; Mount: Surface Mount; Case/Package: SOIC; Number of Pins: 8; Min Operating Temperature: -40°C; Max Operating Temperature: 150°C; Package Quantity: 1; Packaging: Tape and Reel; Operating Supply Current: 11mA; Lead Free: Lead Free; ComponentLink1URL: https://www.melexis.com/-/media/files/documents/datasheets/mlx91205-datasheet-melexis.pdf?src-supplier=Digi-Key; ComponentLink1Description: https://www.melexis.com/-/media/files/documents/datasheets/mlx91205-datasheet-melexis.pdf?src-supplier=Digi-Key; ComponentLink2URL: http://www.melexis.com/Asset/Datasheet-MLX91205-DownloadLink-5505.aspx?src-supplier=Future+Electronics; ComponentLink2Description: http://www.melexis.com/Asset/Datasheet-MLX91205-DownloadLink-5505.aspx?src-supplier=Future+Electronics; Supplier Part Number 1: MLX91205KDC-AAL-003-RE-ND